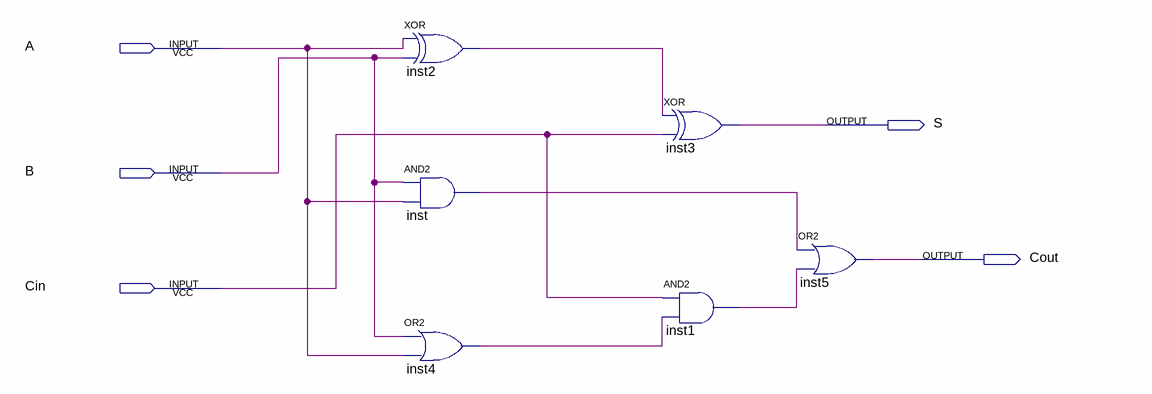
[diagram p0: schematic sheet]
// Quartus schematic FA.bdf as structural Verilog: 6 symbols, 5 pins
module FA (
  input  A,
  input  B,
  input  Cin,
  output S,
  output Cout
);

  wire inst1_out, inst2_out, inst4_out, inst_out;

  xor inst2 (inst2_out, A, B);
  and inst (inst_out, B, A);
  or inst4 (inst4_out, B, A);
  xor inst3 (S, inst2_out, Cin);
  and inst1 (inst1_out, Cin, inst4_out);
  or inst5 (Cout, inst_out, inst1_out);
endmodule
